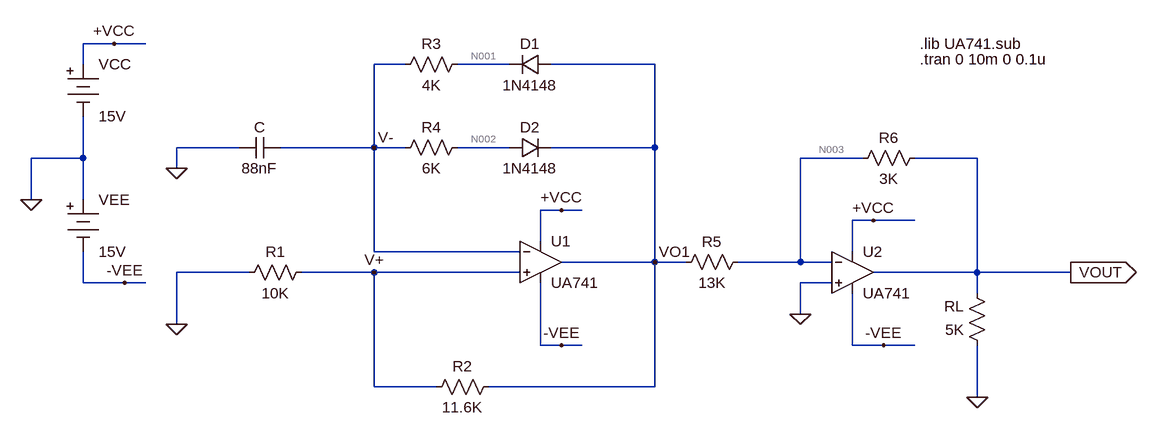
[diagram p0: schematic lab2-1.asc]
lab2-1.asc, the LTspice schematic file:
Version 4
SHEET 1 1192 680
WIRE -416 -160 -464 -160
WIRE -368 -160 -416 -160
WIRE -464 -128 -464 -160
WIRE 32 -128 -16 -128
WIRE 192 -128 112 -128
WIRE 416 -128 256 -128
WIRE -224 0 -320 0
WIRE -16 0 -16 -128
WIRE -16 0 -160 0
WIRE 32 0 -16 0
WIRE 192 0 112 0
WIRE 416 0 416 -128
WIRE 416 0 256 0
WIRE -464 16 -464 -48
WIRE -464 16 -544 16
WIRE 736 16 640 16
WIRE 912 16 816 16
WIRE -320 32 -320 0
WIRE -544 80 -544 16
WIRE -464 80 -464 16
WIRE 272 96 240 96
WIRE 304 96 272 96
WIRE 752 112 720 112
WIRE 816 112 752 112
WIRE 240 144 240 96
WIRE -16 160 -16 0
WIRE 208 160 -16 160
WIRE 720 160 720 112
WIRE 416 176 416 0
WIRE 416 176 272 176
WIRE 464 176 416 176
WIRE 640 176 640 16
WIRE 640 176 544 176
WIRE 688 176 640 176
WIRE -208 192 -320 192
WIRE -16 192 -128 192
WIRE 208 192 -16 192
WIRE 912 192 912 16
WIRE 912 192 752 192
WIRE 1056 192 912 192
WIRE -464 208 -464 160
WIRE -400 208 -464 208
WIRE -368 208 -400 208
WIRE 688 208 640 208
WIRE 912 224 912 192
WIRE 640 256 640 208
WIRE -320 272 -320 192
WIRE 240 304 240 208
WIRE 272 304 240 304
WIRE 304 304 272 304
WIRE 720 304 720 224
WIRE 768 304 720 304
WIRE 816 304 768 304
WIRE -16 368 -16 192
WIRE 80 368 -16 368
WIRE 416 368 416 176
WIRE 416 368 160 368
WIRE 912 384 912 304
FLAG -16 0 V-
FLAG 416 176 VO1
FLAG 1056 192 VOUT
IOPIN 1056 192 Out
FLAG 272 96 +VCC
FLAG 272 304 -VEE
FLAG 752 112 +VCC
FLAG 768 304 -VEE
FLAG -320 32 0
FLAG -320 272 0
FLAG 912 384 0
FLAG 640 256 0
FLAG -544 80 0
FLAG -416 -160 +VCC
FLAG -400 208 -VEE
FLAG -16 192 V+
SYMBOL Opamps\\opamp2 240 112 R0
SYMATTR InstName U1
SYMATTR Value UA741
SYMBOL Opamps\\opamp2 720 128 R0
SYMATTR InstName U2
SYMATTR Value UA741
SYMBOL cap -160 -16 R90
WINDOW 0 0 32 VBottom 2
WINDOW 3 32 32 VTop 2
SYMATTR InstName C
SYMATTR Value 88nF
SYMBOL res 128 -144 R90
WINDOW 0 0 56 VBottom 2
WINDOW 3 32 56 VTop 2
SYMATTR InstName R3
SYMATTR Value 4K
SYMBOL res 128 -16 R90
WINDOW 0 0 56 VBottom 2
WINDOW 3 32 56 VTop 2
SYMATTR InstName R4
SYMATTR Value 6K
SYMBOL res -112 176 R90
WINDOW 0 0 56 VBottom 2
WINDOW 3 32 56 VTop 2
SYMATTR InstName R1
SYMATTR Value 10K
SYMBOL res 560 160 R90
WINDOW 0 0 56 VBottom 2
WINDOW 3 32 56 VTop 2
SYMATTR InstName R5
SYMATTR Value 13K
SYMBOL res 832 0 R90
WINDOW 0 0 56 VBottom 2
WINDOW 3 32 56 VTop 2
SYMATTR InstName R6
SYMATTR Value 3K
SYMBOL res 928 320 R180
WINDOW 0 36 76 Left 2
WINDOW 3 36 40 Left 2
SYMATTR InstName RL
SYMATTR Value 5K
SYMBOL Misc\\battery -464 -144 R0
SYMATTR InstName VCC
SYMATTR Value 15V
SYMBOL Misc\\battery -464 64 R0
SYMATTR InstName VEE
SYMATTR Value 15V
SYMBOL diode 256 -144 R90
WINDOW 0 0 32 VBottom 2
WINDOW 3 32 32 VTop 2
SYMATTR InstName D1
SYMATTR Value 1N4148
SYMBOL diode 192 16 R270
WINDOW 0 32 32 VTop 2
WINDOW 3 0 32 VBottom 2
SYMATTR InstName D2
SYMATTR Value 1N4148
SYMBOL res 176 352 R90
WINDOW 0 0 56 VBottom 2
WINDOW 3 32 56 VTop 2
SYMATTR InstName R2
SYMATTR Value 11.6K
TEXT 824 -160 Left 2 !.lib UA741.sub
TEXT 824 -136 Left 2 !.tran 0 10m 0 0.1u

The netlist it stands for:
* lab2-1.asc
XU1 V+ V- +VCC -VEE VO1 UA741  ; pins In+ In- V+ V- OUT
XU2 0 N003 +VCC -VEE VOUT UA741  ; pins In+ In- V+ V- OUT
C V- 0 88nF
R3 N001 V- 4K
R4 N002 V- 6K
R1 V+ 0 10K
R5 N003 VO1 13K
R6 VOUT N003 3K
RL 0 VOUT 5K
VCC +VCC 0 15V
VEE 0 -VEE 15V
D1 VO1 N001 1N4148
D2 N002 VO1 1N4148
R2 VO1 V+ 11.6K
.model D D
.lib standard.dio
.lib UA741.sub
.tran 0 10m 0 0.1u
.backanno
.end

* Results of the author's LTspice run, read from the files saved beside the schematic
* Operating Point, zero values left out:
*   V(vo1) = 291.4 mV
*   V(-vee) = -15 V
*   V(+vcc) = 15 V
*   V(v-) = 134.5 mV
*   V(v+) = 134.5 mV
*   V(vout) = -67 mV
*   V(n003) = 11.54 µV
*   V(n001) = 134.8 mV
*   V(n002) = 134.5 mV
*   I(D2) = -2.441 nA
*   I(D1) = 77.37 nA
*   I(R2) = 13.53 µA
*   I(Rl) = 13.4 µA
*   I(R6) = -22.34 µA
*   I(R5) = -22.42 µA
*   I(R1) = 13.45 µA
*   I(R4) = 2.441 nA
*   I(R3) = 77.37 nA
*   I(Vee) = -3.333 mA
*   I(Vcc) = -3.333 mA
*   Ix(u1:1) = 79.79 nA
*   Ix(u1:2) = 79.81 nA
*   Ix(u1:3) = 1.667 mA
*   Ix(u1:4) = -1.667 mA
*   Ix(u1:5) = -36.03 µA
*   Ix(u2:1) = 79.74 nA
*   Ix(u2:2) = 79.76 nA
*   Ix(u2:3) = 1.667 mA
*   Ix(u2:4) = -1.667 mA
*   Ix(u2:5) = 35.74 µA
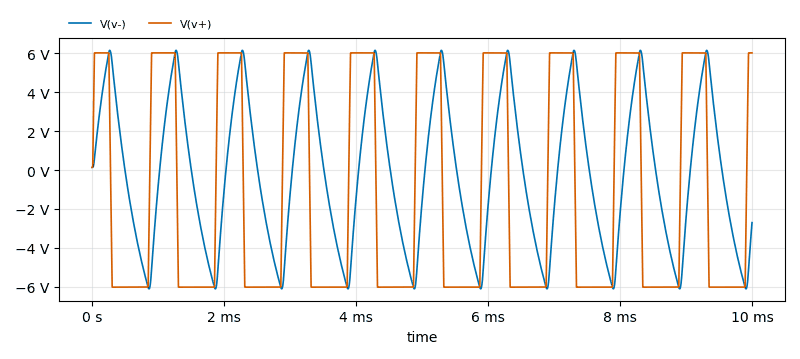
[diagram p1: Transient Analysis of lab2-1.asc, plotted from the saved traces]
* Transient Analysis, 1 run:
*   V(v-): min -6.106 V, max 6.15 V, average -174.5 mV, rms 3.836 V, last -2.705 V
*   V(v+): min -6.021 V, max 6.02 V, average -1.177 V, rms 5.814 V, last 6.02 V